# EAGLE schematic Gyro (EAGLE 9.6.2)
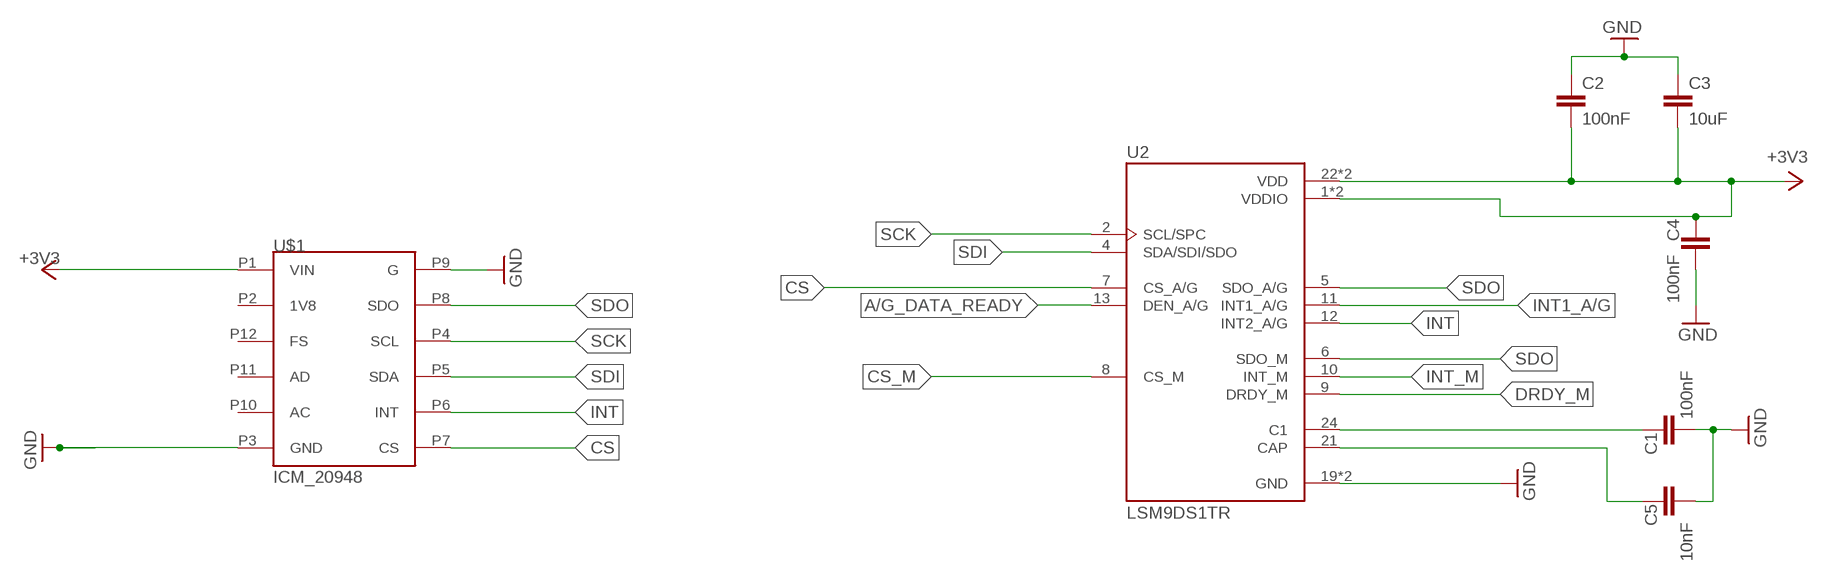
[diagram p0: schematic, sheet 1]

## Parts
C1  100nF  C-EUC0805  [C0805]
C2  100nF  C-EUC0805  [C0805]
C3  10uF  C-EUC0805  [C0805]
C4  100nF  C-EUC0805  [C0805]
C5  10nF  C-EUC0805  [C0805]
U2  LSM9DS1TR  [PQFN43P300X350X102-24N]
U$1  ICM_20948  [ICM_20948-F]

## Nets
+3V3: C2.2 C3.2 C4.2 U2.1(VDDIO) U2.3(VDDIO) U2.22(VDD) U2.23(VDD) U$1.P1(VIN)
A/G_DATA_READY: U2.13(DEN_A/G)
CS: U2.7(CS_A/G) U$1.P7(CS)
CS_M: U2.8(CS_M)
DRDY_M: U2.9(DRDY_M)
GND: C1.2 C2.1 C3.1 C4.1 C5.2 U2.19(GND) U2.20(GND) U$1.P3(GND) U$1.P9(G)
INT: U2.12(INT2_A/G) U$1.P6(INT)
INT1_A/G: U2.11(INT1_A/G)
INT_M: U2.10(INT_M)
N$1: C5.1 U2.21(CAP)
N$27: C1.1 U2.24(C1)
SCK: U2.2(SCL/SPC) U$1.P4(SCL)
SDI: U2.4(SDA/SDI/SDO) U$1.P5(SDA)
SDO: U2.5(SDO_A/G) U2.6(SDO_M) U$1.P8(SDO)
Unconnected: U$1.P2(1V8) U$1.P10(AC) U$1.P11(AD) U$1.P12(FS)

## Library data of the parts
C1-C5 = rcl:C-EU: CAPACITOR, European symbol; SPICEPREFIX: C
U2 = LSM9DS1TR:LSM9DS1TR: The LSM9DS1 is a system-in-package featuring a 3D digital linear acceleration sensor, a 3D digital angular rate sensor, and a 3D digital magnetic sensor. Check availability <https://pricing.snapeda.com/parts/LSM9DS1TR/STMicroelectronics/view-part?ref=eda>; AVAILABILITY: In Stock; DESCRIPTION: Accelerometer, Gyroscope, Magnetometer, Temperature, 9 Axis Sensor I²C, SPI Output; MF: STMicroelectronics; MP: LSM9DS1TR; PACKAGE: TFLGA-24 STMicroelectronics; PRICE: None; PURCHASE-URL: https://pricing.snapeda.com/search/part/LSM9DS1TR/?ref=eda
U$1 = ICM-20948:ICM_20948: The ICM20948 from Invensense packs 9 Degrees of freedom into a teeny package, making it a one stop shop for all the DOFs you need! Within it’s svelte 3x3mm package there are not just one MEMS sensor die like your common sensors, but two sensor dies!